# EAGLE design Module_I2C_TOF (EAGLE 9.6.2)
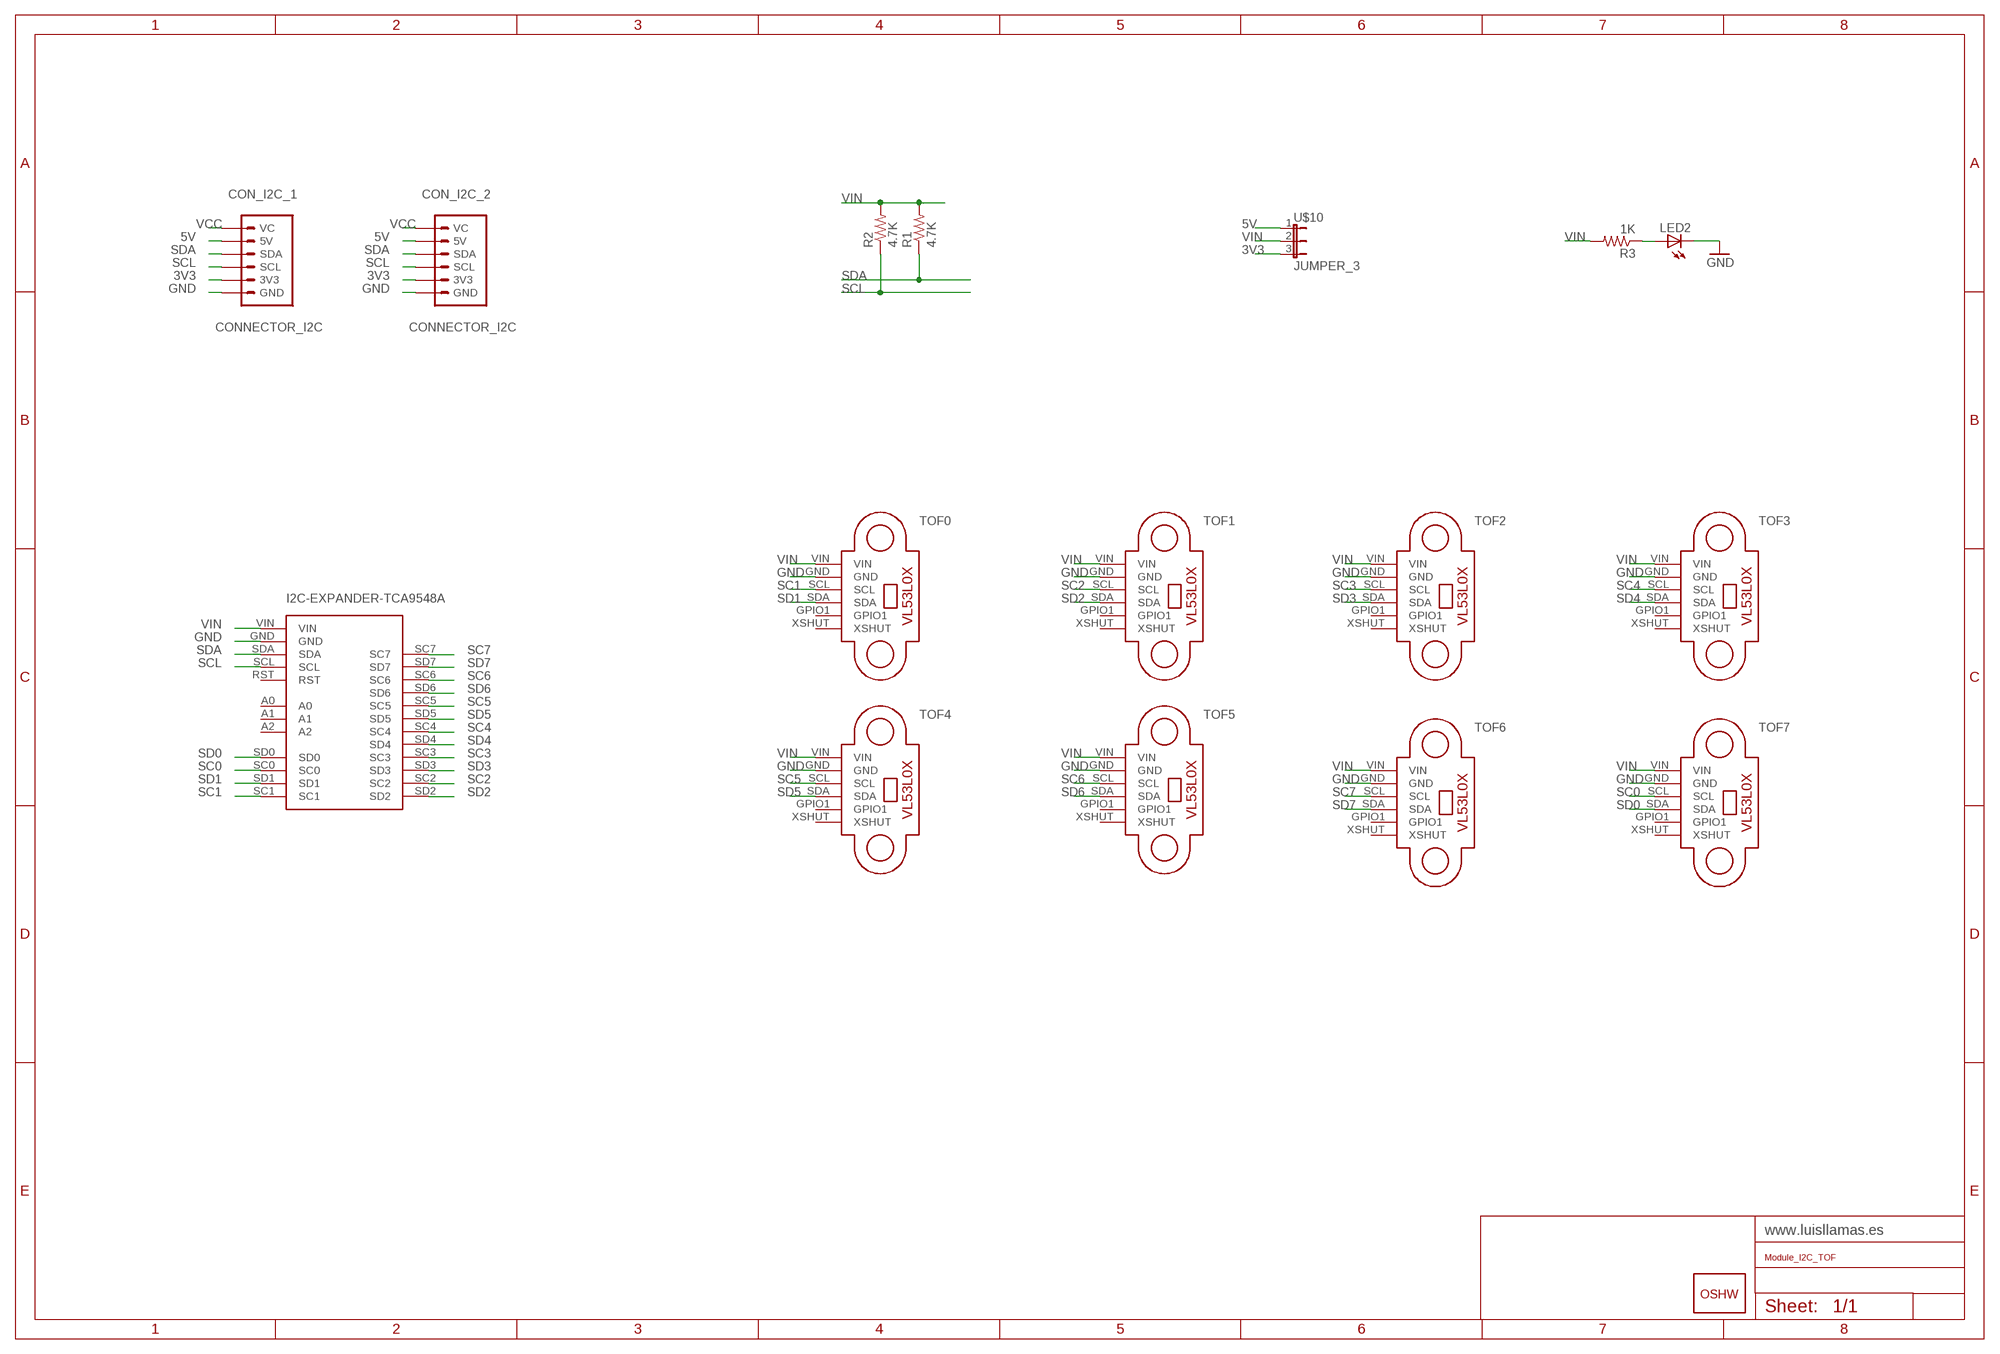
[diagram p0: schematic, sheet 1]

## Parts
CON_I2C_1  CONNECTOR_I2C  [CONNECTOR_I2C]
CON_I2C_2  CONNECTOR_I2C  [CONNECTOR_I2C]
GOLD_ORB_SM1  OSHWLOGO_GOLD_ORB_MED  [OSHW1]
LED2  LEDCHIP-LED0805  [CHIP-LED0805]
R1  4.7K  R-US_R0805  [R0805]
R2  4.7K  R-US_R0805  [R0805]
R3  1K  R-US_R0805  [R0805]
TOF0  RANGING-SENSOR-VL53L0X  [RANGING-SENSOR-VL53L0X]
TOF1  RANGING-SENSOR-VL53L0X  [RANGING-SENSOR-VL53L0X]
TOF2  RANGING-SENSOR-VL53L0X  [RANGING-SENSOR-VL53L0X]
TOF3  RANGING-SENSOR-VL53L0X  [RANGING-SENSOR-VL53L0X]
TOF4  RANGING-SENSOR-VL53L0X  [RANGING-SENSOR-VL53L0X]
TOF5  RANGING-SENSOR-VL53L0X  [RANGING-SENSOR-VL53L0X]
TOF6  RANGING-SENSOR-VL53L0X  [RANGING-SENSOR-VL53L0X]
TOF7  RANGING-SENSOR-VL53L0X  [RANGING-SENSOR-VL53L0X]
U$9  I2C-EXPANDER-TCA9548A  [I2C-EXPANDER-TCA9548A]
U$10  JUMPER_3  [JUMPER_3]

## Nets
3V3: CON_I2C_1.3V3 CON_I2C_2.3V3 U$10.3
5V: CON_I2C_1.5V CON_I2C_2.5V U$10.1
GND: CON_I2C_1.GND CON_I2C_2.GND LED2.C TOF0.GND TOF1.GND TOF2.GND TOF3.GND TOF4.GND TOF5.GND TOF6.GND TOF7.GND U$9.GND
N$1: LED2.A R3.1
SC0: TOF7.SCL U$9.SC0
SC1: TOF0.SCL U$9.SC1
SC2: TOF1.SCL U$9.SC2
SC3: TOF2.SCL U$9.SC3
SC4: TOF3.SCL U$9.SC4
SC5: TOF4.SCL U$9.SC5
SC6: TOF5.SCL U$9.SC6
SC7: TOF6.SCL U$9.SC7
SCL: CON_I2C_1.SCL CON_I2C_2.SCL R2.1 U$9.SCL
SD0: TOF7.SDA U$9.SD0
SD1: TOF0.SDA U$9.SD1
SD2: TOF1.SDA U$9.SD2
SD3: TOF2.SDA U$9.SD3
SD4: TOF3.SDA U$9.SD4
SD5: TOF4.SDA U$9.SD5
SD6: TOF5.SDA U$9.SD6
SD7: TOF6.SDA U$9.SD7
SDA: CON_I2C_1.SDA CON_I2C_2.SDA R1.1 U$9.SDA
VCC: CON_I2C_1.VC CON_I2C_2.VC
VIN: R1.2 R2.2 R3.2 TOF0.VIN TOF1.VIN TOF2.VIN TOF3.VIN TOF4.VIN TOF5.VIN TOF6.VIN TOF7.VIN U$9.VIN U$10.2
Unconnected: TOF0.GPIO1 TOF0.XSHUT TOF1.GPIO1 TOF1.XSHUT TOF2.GPIO1 TOF2.XSHUT TOF3.GPIO1 TOF3.XSHUT TOF4.GPIO1 TOF4.XSHUT TOF5.GPIO1 TOF5.XSHUT TOF6.GPIO1 TOF6.XSHUT TOF7.GPIO1 TOF7.XSHUT U$9.A0 U$9.A1 U$9.A2 U$9.RST

## Library data of the parts
CON_I2C_1 CON_I2C_2 = LLL_Connectors:CONNECTOR_I2C
GOLD_ORB_SM1 = LLL_Frames:OSHWLOGO: These are Open-Source Hardware logos.
LED2 = led:LED: LED OSRAM: - CHIPLED LG R971, LG N971, LY N971, LG Q971, LY Q971, LO R971, LY R971 LH N974, LH R974 LS Q976, LO Q976, LY Q976 LO Q996 - Hyper CHIPLED LW Q18S LB Q993, LB Q99A, LB R99A - SideLED LS A670, LO A670, LY A670, LG A670, LP A670 LB A673, LV A673, LT A673, LW A673 LH A674 LY A675 LS A676, LA A676, LO A676, LY A676, LW A676 LS A679, LY A679, LG A679 - Hyper Micro SIDELED® LS Y876, LA Y876, LO Y876, LY Y876 LT Y87S - SmartLED LW L88C, LW L88S LB L89C, LB L89S, LG L890 LS L89K, LO L89K, LY L89K LS L896, LA L896, LO L896, LY L896 - TOPLED LS T670, LO T670, LY T670, LG T670, LP T670 LSG T670, LSP T670, LSY T670, LOP T670, LYG T670 LG T671, LOG T671, LSG T671 LB T673, LV T673, LT T673, LW T673 LH T674 LS T676, LA T676, LO T676, LY T676, LB T676, LH T676, LSB T676, LW T676 LB T67C, LV T67C, LT T67C, LS T67K, LO T67K, LY T67K, LW E67C LS E67B, LA E67B, LO E67B, LY E67B, LB E67C, LV E67C, LT E67C LW T67C LS T679, LY T679, LG T679 LS T770, LO T770, LY T770, LG T770, LP T770 LB T773, LV T773, LT T773, LW T773 LH T774 LS E675, LA E675, LY E675, LS T675 LS T776, LA T776, LO T776, LY T776, LB T776 LHGB T686 LT T68C, LB T68C - Hyper Mini TOPLED® LB M676 - Mini TOPLED Santana® LG M470 LS M47K, LO M47K, LY M47K Source: http://www.osram.convergy.de LUXEON: - LUMILED® LXK2-PW12-R00, LXK2-PW12-S00, LXK2-PW14-U00, LXK2-PW14-V00 LXK2-PM12-R00, LXK2-PM12-S00, LXK2-PM14-U00 LXK2-PE12-Q00, LXK2-PE12-R00, LXK2-PE12-S00, LXK2-PE14-T00, LXK2-PE14-U00 LXK2-PB12-K00, LXK2-PB12-L00, LXK2-PB12-M00, LXK2-PB14-N00, LXK2-PB14-P00, LXK2-PB14-Q00 LXK2-PR12-L00, LXK2-PR12-M00, LXK2-PR14-Q00, LXK2-PR14-R00 LXK2-PD12-Q00, LXK2-PD12-R00, LXK2-PD12-S00 LXK2-PH12-R00, LXK2-PH12-S00 LXK2-PL12-P00, LXK2-PL12-Q00, LXK2-PL12-R00 Source: www.luxeon.com KINGBRIGHT: KA-3528ASYC Source: www.kingbright.com
R1-R3 = adafruit:R-US_: RESISTOR, American symbol
TOF0 TOF1-TOF7 = LLL_Modules:RANGING-SENSOR-VL53L0X: Laser Ranging Sensor based on VL53L0X device More information about VL53L0X device can be found here: http://www.st.com/en/imaging-and-photonics-solutions/vl53l0x.html Arduino Library for VL53L0X is available here: https://github.com/pololu/vl53l0x-arduino Click here to find device on ebay.com <http://www.ebay.com/sch/GY+VL53L0X+module> Note: There are many variants. Search for the proper version.
U$9 = LLL_Modules:I2C-EXPANDER-TCA9548A: 4 Channel 16-Bit Analog-to-Digital Converter based on ADS1115 chip Arduino ADS1115 Getting Started Tutorial is available here: http://henrysbench.capnfatz.com/henrys-bench/arduino-voltage-measurements/arduino-ads1115-module-getting-started-tutorial/ ADS1115 datasheet is available here: http://www.ti.com/lit/ds/symlink/ads1115.pdf Click here to find device on ebay.com <http://www.ebay.com/sch/ads1115+module>
U$10 = LLL_Jumpers:JUMPER_3

## Net classes
0 default: clearance 0.205 mm

## Board
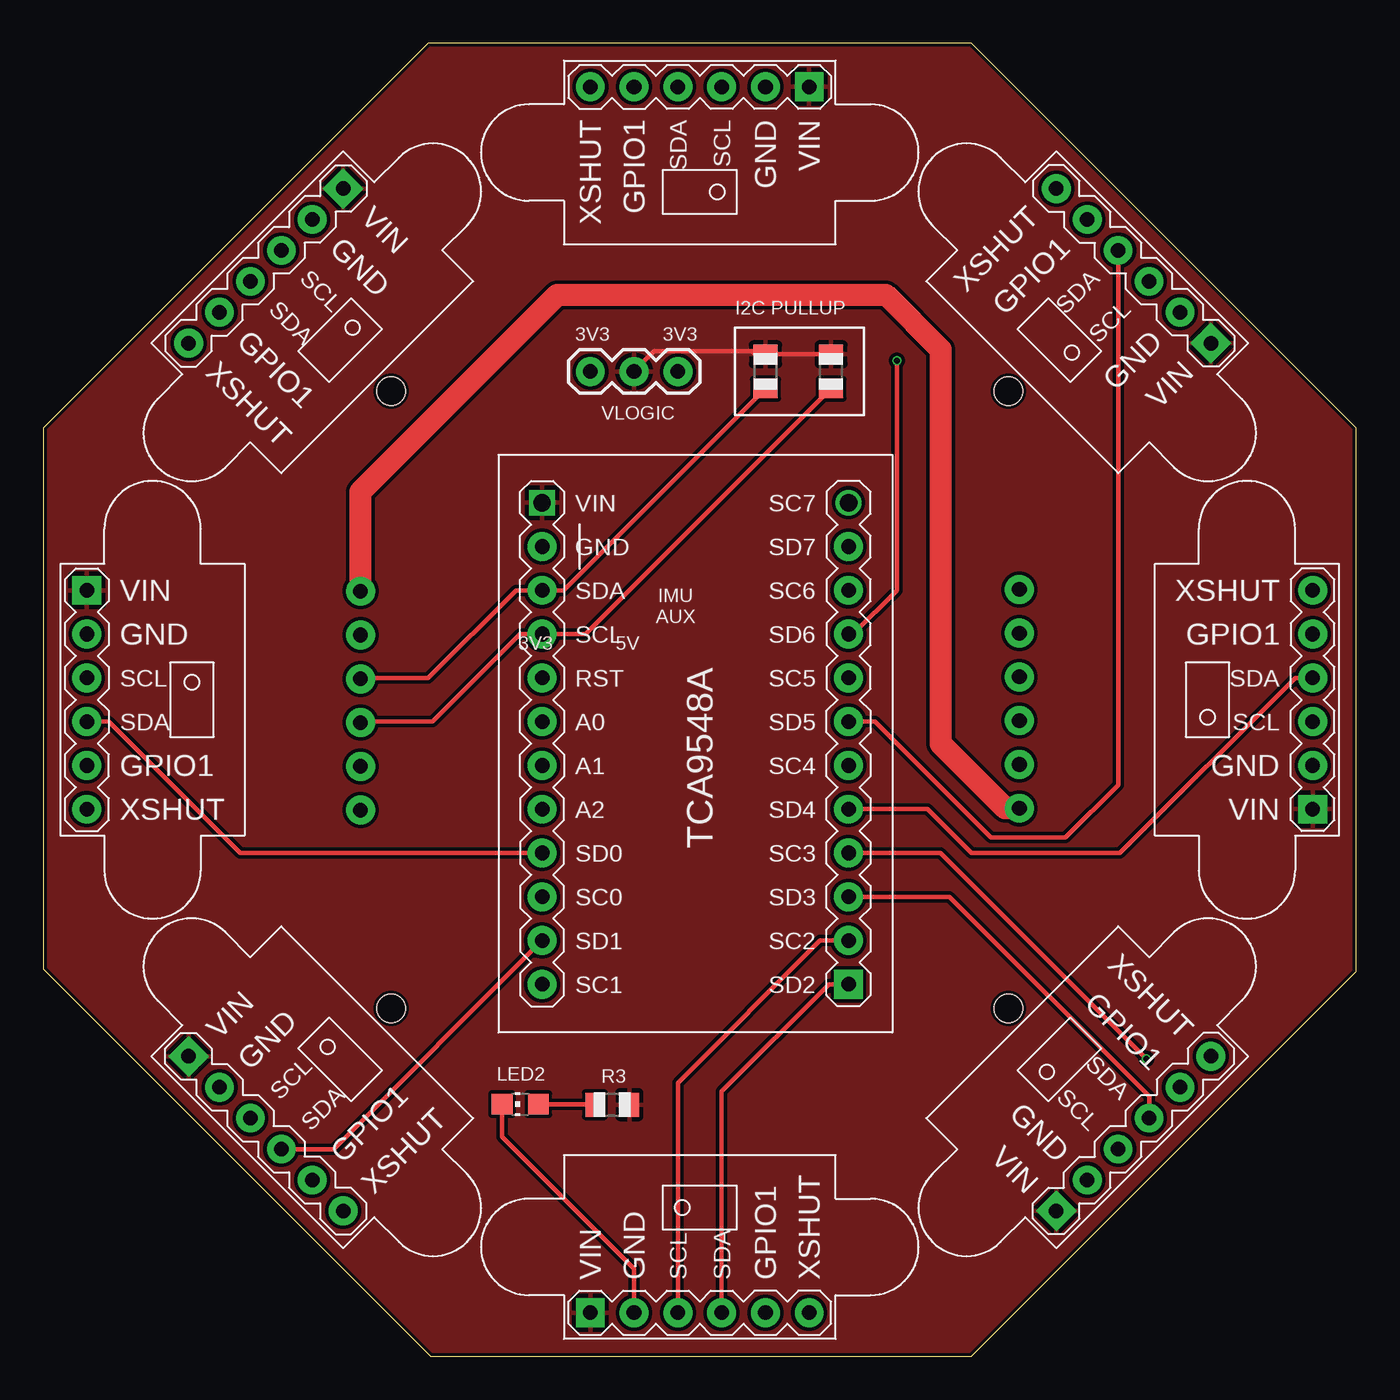
[diagram p1: board, top side]
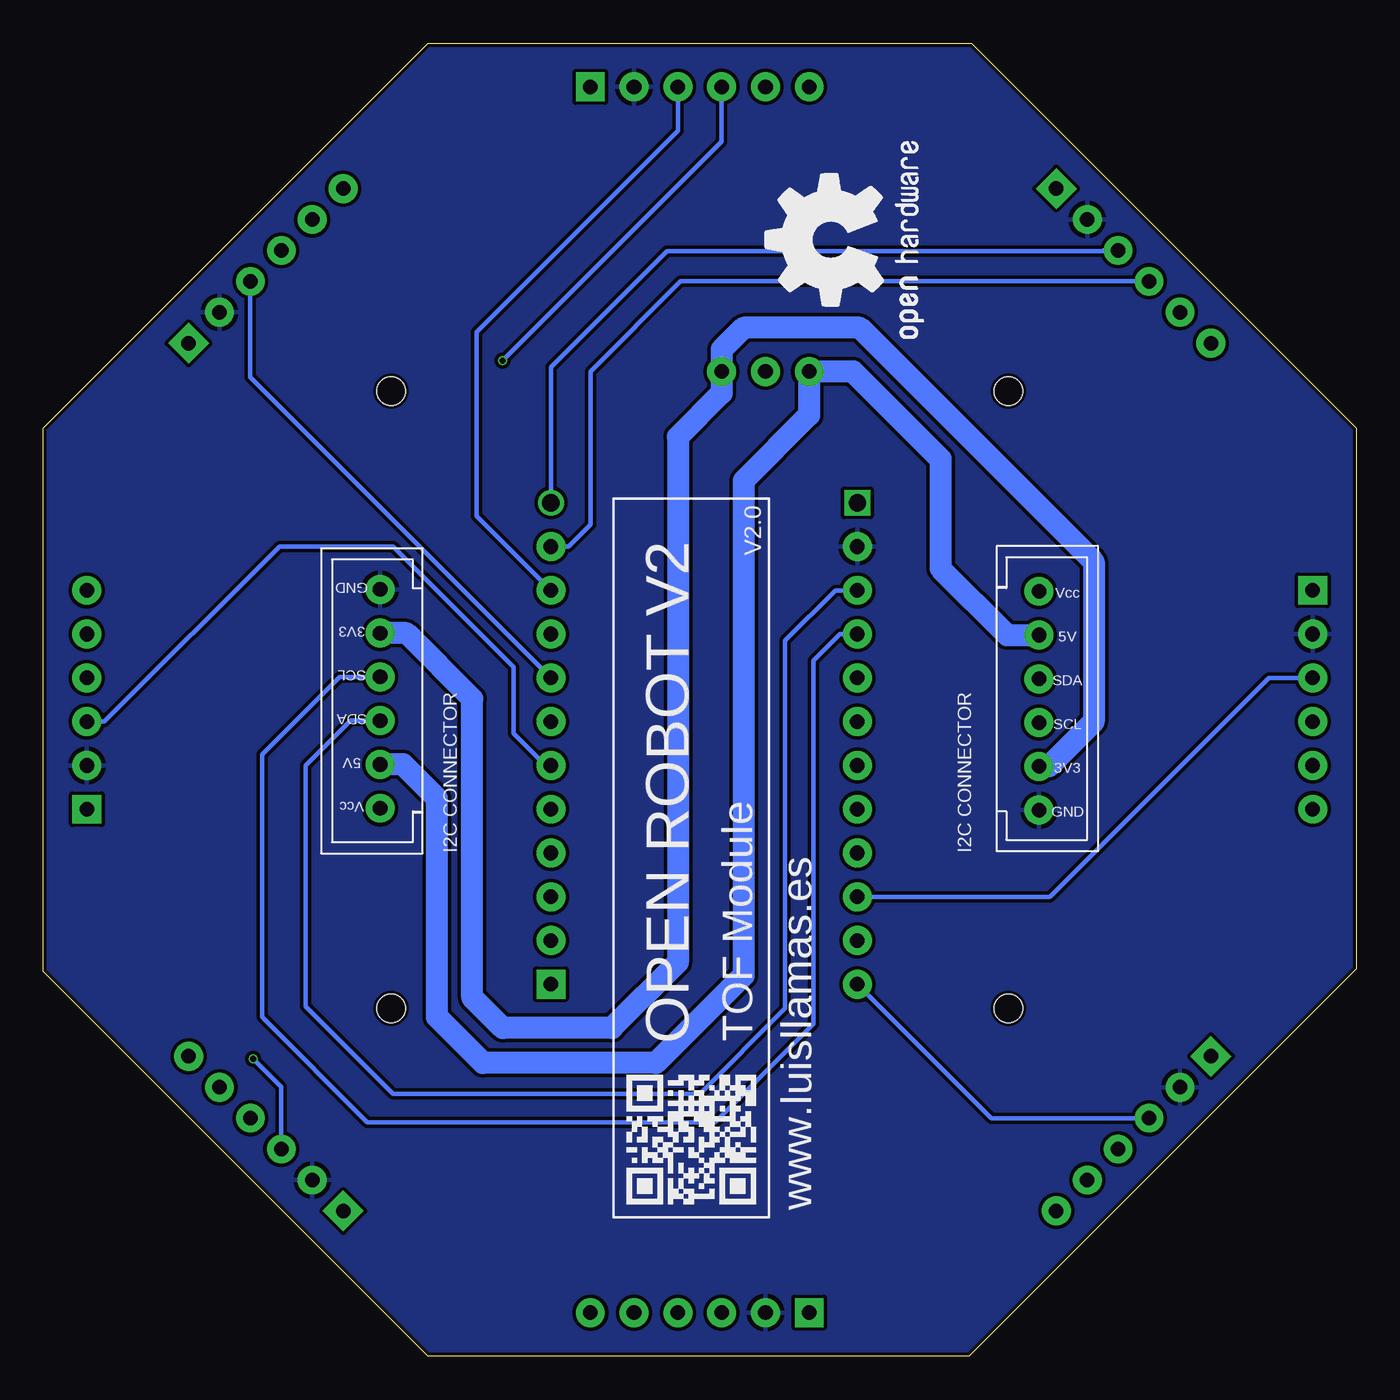
[diagram p2: board, bottom side, seen from below]

Size 76.2 x 76.2 mm. Coordinates in mm from the lower left corner, seen from the top.
Outline: 76.2,22.35 76.2,53.85 53.85,76.2 22.35,76.2 0,53.85 0,22.48 22.48,0 53.85,0 76.2,22.35
Copper layers (1*16): Top 0.035559375mm / dielectric 1.6mm / Bottom 0.035559375mm
Design rules "jlcpcb2layer": minimum track width 5mil, minimum drill 12mil, track to track 5mil, track to pad 5mil, pad to pad 5mil, via to via 5mil, smd to smd 5mil, copper to edge 8mil, drill to drill 6mil, minimum pad ring 5mil, minimum via ring 3mil, stop-mask expansion 2.5mil, vias tented up to drill 0mil, thermal gap 10mil
Holes 1.65 mm at 20.19,56.01 20.19,20.19 56.01,56.01 56.01,20.19

### Footprints (pad centres in the part's own frame; a part is rotated, then mirrored left to right if it is on the bottom)
CONNECTOR_I2C = drill 0.85 pad 1.676: 3V3 0,3.866; 5V 0,-3.754; GND 0,6.406; SCL 0,1.326; SDA 0,-1.214; VC 0,-6.294
CHIP-LED0805 = smd 1.2 x 1.2: A 0,-1.05; C 0,1.05
R0805 = smd 1.1 x 1.4: 1 -1,0; 2 1,0
RANGING-SENSOR-VL53L0X = drill 0.85 pad 1.676: GND -3.81,3.81; GPIO1 -3.81,-3.81; SCL -3.81,1.27; SDA -3.81,-1.27; XSHUT -3.81,-6.35 | drill 0.85 pad 1.676 square: VIN -3.81,6.35
I2C-EXPANDER-TCA9548A = drill 0.85 pad 1.676: A0 -6.35,-1.27; A1 -6.35,-3.81; A2 -6.35,-6.35; GND -6.35,8.89; RST -6.35,1.27; SC0 -6.35,-11.43; SC1 -6.35,-16.51; SC2 11.43,-13.97; SC3 11.43,-8.89; SC4 11.43,-3.81; SC5 11.43,1.27; SC6 11.43,6.35; SCL -6.35,3.81; SD0 -6.35,-8.89; SD1 -6.35,-13.97; SD3 11.43,-11.43; SD4 11.43,-6.35; SD5 11.43,-1.27; SD6 11.43,3.81; SD7 11.43,8.89; SDA -6.35,6.35 | drill 1: SC7 11.43,11.43 | drill 0.85 pad 1.676 square: SD2 11.43,-16.51 | drill 1 square: VIN -6.35,11.43
JUMPER_3 = drill 0.85 pad 1.676: 1 0,0; 2 2.54,0; 3 5.08,0

### Placement (x,y rotation side)
CON_I2C_1  56.64,38.1 0 bottom
CON_I2C_2  18.41,38.1 180 bottom
GOLD_ORB_SM1  23.37,58.42 90 bottom
LED2  27.69,14.64 90 top
R1  41.91,57.15 90 top
R2  45.72,57.15 90 top
R3  33.02,14.61 0 top
TOF0  15.62,15.62 45 top
TOF1  38.1,6.35 90 top
TOF2  60.58,15.62 135 top
TOF3  69.85,38.1 180 top
TOF4  60.58,60.58 225 top
TOF5  38.1,69.85 270 top
TOF6  15.62,60.58 315 top
TOF7  6.35,38.1 0 top
U$9  35.31,38.1 0 top
U$10  31.75,57.15 0 top

### Tracks (layer width: path | path; a pad name or v marks a point on that pad's centre or on a via)
3V3
  Bottom 1.27: CON_I2C_1.3V3 55.12,41.97 51.31,38.16 51.31,20.83 49.53,19.05 43.18,19.05 39.37,22.86 39.37,53.34 36.83,55.88 U$10.3 36.83,58.42 35.56,59.69 28.81,59.69 15.24,46.12 15.24,36.83 17.84,34.23 CON_I2C_2.3V3
5V
  Bottom 1.27: CON_I2C_1.5V 55.3,34.35 53.34,32.38 53.34,19.68 50.67,17.02 40.64,17.02 35.56,22.1 35.56,50.8 31.75,54.61 U$10.1 29.21,57.15 24.13,52.07 24.13,45.72 20.26,41.85 CON_I2C_2.5V
GND
  Top 0.254: LED2.C 26.64,12.73 34.29,5.08 TOF1.GND
  pour Bottom (rank 2): 53.85,0 22.48,0 0,22.48 0,53.85 22.35,76.2 53.85,76.2 76.2,53.85 76.2,22.35
N$1
  Top 0.254: LED2.A 31.99,14.64 R3.1
SC0
  Bottom 0.254: U$9.SC0 17.78,26.67 8.89,35.56 5.08,39.37 TOF7.SCL
SC1
  Bottom 0.254: U$9.SC1 21.19,13.82 TOF0.SCL
SC2
  Top 0.254: U$9.SC2 45.09,24.13 36.83,15.88 TOF1.SCL
SC3  (via drill 0.35)
  Top 0.254: U$9.SC3 52.07,29.21 v64.01,17.27
  Bottom 0.254: v64.01,17.27 62.38,15.64 TOF2.SCL
SC4
  Bottom 0.254: U$9.SC4 47.05,34.29 48.9,36.14 48.9,40.01 55.88,46.99 62.48,46.99 72.64,36.83 TOF3.SCL
SC5
  Bottom 0.254: U$9.SC5 64.17,56.8 TOF4.SCL
SC6
  Bottom 0.254: U$9.SC6 51.05,48.77 51.05,59.44 39.37,71.12 TOF5.SCL
SC7
  Bottom 0.254: TOF6.SCL 14.64,64.17 14.68,64.14 40.01,64.14 46.74,57.4 U$9.SC7
SCL
  Top 0.254: CON_I2C_2.SCL 18.47,36.83 22.61,36.83 27.69,41.91 U$9.SCL 31.48,41.91 R2.1
  Bottom 0.254: CON_I2C_1.SCL 59,39.43 63.5,34.92 63.5,19.68 57.4,13.59 37.21,13.59 31.5,19.3 31.5,40.39 29.97,41.91 U$9.SCL
SD0
  Top 0.254: U$9.SD0 11.43,29.21 3.81,36.83 TOF7.SDA
SD1
  Top 0.254: U$9.SD1 16.86,12.03 TOF0.SDA
SD2
  Top 0.254: U$9.SD2 45.59,21.59 39.37,15.37 TOF1.SDA
SD3
  Top 0.254: U$9.SD3 52.6,26.67 64.17,15.1 TOF2.SDA
SD4
  Top 0.254: U$9.SD4 51.31,31.75 53.85,29.21 62.48,29.21 72.64,39.37 TOF3.SDA
SD5
  Top 0.254: U$9.SD5 48.26,36.83 54.99,30.1 59.31,30.1 62.38,33.16 TOF4.SDA
SD6  (via drill 0.35)
  Top 0.254: U$9.SD6 46.99,41.91 49.53,44.45 v49.53,57.78
  Bottom 0.254: v49.53,57.78 36.83,70.48 TOF5.SDA
SD7
  Bottom 0.254: TOF6.SDA 39.23,62.38 44.45,57.15 44.45,48.26 45.72,46.99 U$9.SD7
SDA
  Top 0.254: CON_I2C_2.SDA 18.47,39.37 22.35,39.37 27.43,44.45 U$9.SDA 30.21,44.45 R1.1
  Bottom 0.254: U$9.SDA 30.23,44.45 33.15,41.53 33.15,20.19 38.1,15.24 55.88,15.24 60.96,20.32 60.96,34.29 58.36,36.89 CON_I2C_1.SDA
VCC
  Top 1.27: CON_I2C_2.VC 18.41,50.16 29.84,61.59 48.9,61.59 52.07,58.42 52.07,35.56 55.82,31.81 CON_I2C_1.VC
VIN
  Top 0.254: R2.2 R1.2 41.3,58.15 41.12,58.32 35.46,58.32 U$10.2
  pour Top (rank 2): 22.35,76.2 53.85,76.2 76.2,53.85 76.2,22.35 53.85,0 22.48,0 0,22.48 0,53.85

### Text on the board
tPlace: I2C PULLUP | 3V3 | 3V3 | VLOGIC | IMU / AUX | 3V3 | 5V
bPlace: V2.0 | I2C CONNECTOR | I2C CONNECTOR | TOF Module | OPEN ROBOT V2 | www.luisllamas.es